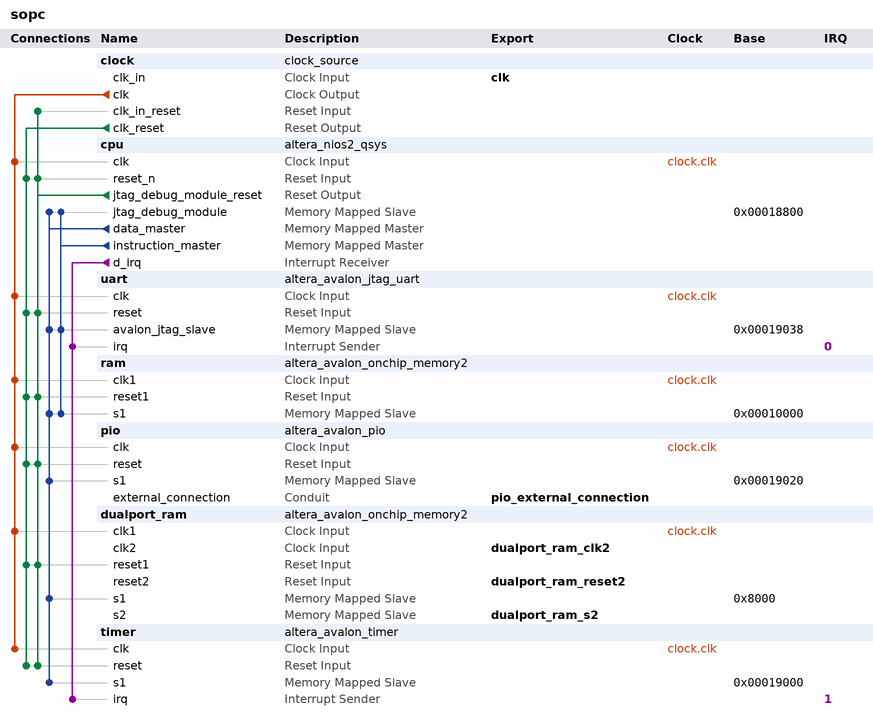
[diagram p0: system contents]
# Platform Designer (Qsys) system sopc, Cyclone IV E EP4CE22F17C6
# Parameters at their usual value, and those the tool derives, are not listed.
package require -exact qsys 13.0.1.99.2
create_system sopc
set_project_property DEVICE_FAMILY {Cyclone IV E}
set_project_property DEVICE EP4CE22F17C6

add_instance clock clock_source 13.0
set_instance_parameter_value clock clockFrequency 50000000

add_instance cpu altera_nios2_qsys 13.0
set_instance_parameter_value cpu manuallyAssignCpuID false
set_instance_parameter_value cpu resetSlave ram.s1
set_instance_parameter_value cpu mmu_TLBMissExcSlave None
set_instance_parameter_value cpu exceptionSlave ram.s1
set_instance_parameter_value cpu breakSlave cpu.jtag_debug_module
set_instance_parameter_value cpu impl Tiny
set_instance_parameter_value cpu icache_size 4096

add_instance uart altera_avalon_jtag_uart 13.0.1.99.2
set_instance_parameter_value uart simInteractiveOptions NO_INTERACTIVE_WINDOWS

add_instance ram altera_avalon_onchip_memory2 13.0.1.99.2
set_instance_parameter_value ram dataWidth 32
set_instance_parameter_value ram dualPort false
set_instance_parameter_value ram initMemContent false
set_instance_parameter_value ram initializationFileName onchip_mem.hex
set_instance_parameter_value ram memorySize 16384

add_instance pio altera_avalon_pio 13.0.1.99.2
set_instance_parameter_value pio direction Output
set_instance_parameter_value pio width 8

add_instance dualport_ram altera_avalon_onchip_memory2 13.0.1.99.2
set_instance_parameter_value dualport_ram dataWidth 32
set_instance_parameter_value dualport_ram dualPort true
set_instance_parameter_value dualport_ram initMemContent false
set_instance_parameter_value dualport_ram initializationFileName onchip_mem.hex
set_instance_parameter_value dualport_ram memorySize 32768

add_instance timer altera_avalon_timer 13.0.1.99.2
set_instance_parameter_value timer alwaysRun true
set_instance_parameter_value timer fixedPeriod true
set_instance_parameter_value timer period 1
set_instance_parameter_value timer periodUnits MSEC
set_instance_parameter_value timer snapshot false

# connections
add_connection clock.clk cpu.clk clock
add_connection clock.clk dualport_ram.clk1 clock
add_connection clock.clk pio.clk clock
add_connection clock.clk ram.clk1 clock
add_connection clock.clk timer.clk clock
add_connection clock.clk uart.clk clock
add_connection clock.clk_reset cpu.reset_n reset
add_connection clock.clk_reset dualport_ram.reset1 reset
add_connection clock.clk_reset pio.reset reset
add_connection clock.clk_reset ram.reset1 reset
add_connection clock.clk_reset timer.reset reset
add_connection clock.clk_reset uart.reset reset
add_connection cpu.jtag_debug_module_reset clock.clk_in_reset reset
add_connection cpu.jtag_debug_module_reset cpu.reset_n reset
add_connection cpu.jtag_debug_module_reset dualport_ram.reset1 reset
add_connection cpu.jtag_debug_module_reset pio.reset reset
add_connection cpu.jtag_debug_module_reset ram.reset1 reset
add_connection cpu.jtag_debug_module_reset timer.reset reset
add_connection cpu.jtag_debug_module_reset uart.reset reset
add_connection cpu.data_master cpu.jtag_debug_module avalon
set_connection_parameter_value cpu.data_master/cpu.jtag_debug_module baseAddress 0x00018800
add_connection cpu.data_master dualport_ram.s1 avalon
set_connection_parameter_value cpu.data_master/dualport_ram.s1 baseAddress 0x8000
add_connection cpu.data_master pio.s1 avalon
set_connection_parameter_value cpu.data_master/pio.s1 baseAddress 0x00019020
add_connection cpu.data_master ram.s1 avalon
set_connection_parameter_value cpu.data_master/ram.s1 baseAddress 0x00010000
add_connection cpu.data_master timer.s1 avalon
set_connection_parameter_value cpu.data_master/timer.s1 baseAddress 0x00019000
add_connection cpu.data_master uart.avalon_jtag_slave avalon
set_connection_parameter_value cpu.data_master/uart.avalon_jtag_slave baseAddress 0x00019038
add_connection cpu.instruction_master cpu.jtag_debug_module avalon
set_connection_parameter_value cpu.instruction_master/cpu.jtag_debug_module baseAddress 0x00018800
add_connection cpu.instruction_master ram.s1 avalon
set_connection_parameter_value cpu.instruction_master/ram.s1 baseAddress 0x00010000
add_connection cpu.instruction_master uart.avalon_jtag_slave avalon
set_connection_parameter_value cpu.instruction_master/uart.avalon_jtag_slave baseAddress 0x00019038
add_connection cpu.d_irq timer.irq interrupt
set_connection_parameter_value cpu.d_irq/timer.irq irqNumber 1
add_connection cpu.d_irq uart.irq interrupt
set_connection_parameter_value cpu.d_irq/uart.irq irqNumber 0

# exported interfaces
add_interface clk clock sink
set_interface_property clk EXPORT_OF clock.clk_in
add_interface pio_external_connection conduit end
set_interface_property pio_external_connection EXPORT_OF pio.external_connection
add_interface dualport_ram_clk2 clock sink
set_interface_property dualport_ram_clk2 EXPORT_OF dualport_ram.clk2
add_interface dualport_ram_s2 avalon slave
set_interface_property dualport_ram_s2 EXPORT_OF dualport_ram.s2
add_interface dualport_ram_reset2 reset sink
set_interface_property dualport_ram_reset2 EXPORT_OF dualport_ram.reset2

set_interconnect_requirement {$system} qsys_mm.clockCrossingAdapter HANDSHAKE
set_interconnect_requirement {$system} qsys_mm.maxAdditionalLatency 1

save_system sopc.qsys
